# Altium schematic sheet PLD_FRAM-Memory.SchDoc: Flash Memory
size A4; SheetTotal: 32
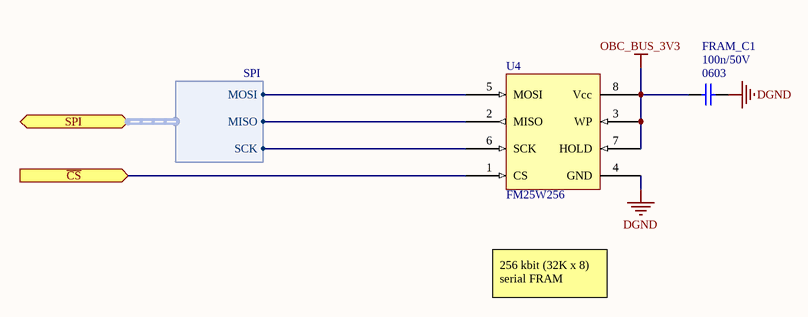
[diagram p0: PLD_FRAM-Memory.SchDoc]

## Parts
FRAM_C1  Package: 0603  [SMD_Capacitor_0603]  (hidden comment: 100n/50V)
U4  FM25W256  [SOIC-8-N]

## Ports
SPI (harness SPI), ~{CS} (in)

## Harnesses
SPI: MISO, MOSI, SCK

## Nets
DGND: FRAM_C1.1 U4.4(GND)
OBC_BUS_3V3: FRAM_C1.2 U4.3(WP) U4.7(HOLD) U4.8(Vcc)
~{CS}: U4.1(CS) ; port ~{CS}
NetU4_2: U4.2(MISO) ; port SPI.MISO
NetU4_5: U4.5(MOSI) ; port SPI.MOSI
NetU4_6: U4.6(SCK) ; port SPI.SCK

## Notes on the sheet
- 256 kbit (32K x 8) serial FRAM
- Title:
- Project:
- Author:
- Model:
- Document Number:
- Checked by:
- Rev:
- Date:
- Approved by:
- Sheet:
- of
- File name:

## Library data of the parts
FRAM_C1 = Cer_C0603T104K5RALTU: Ceramic Cap Kemet COTS 100n/50V X7R 0603; Manufacturer: Kemet; ManufacturerPartNumber: C0603T104K5RALTU; Value: 100n/50V
U4 = FM25W256: 256Kb (8k x 32) SPI F-RAM